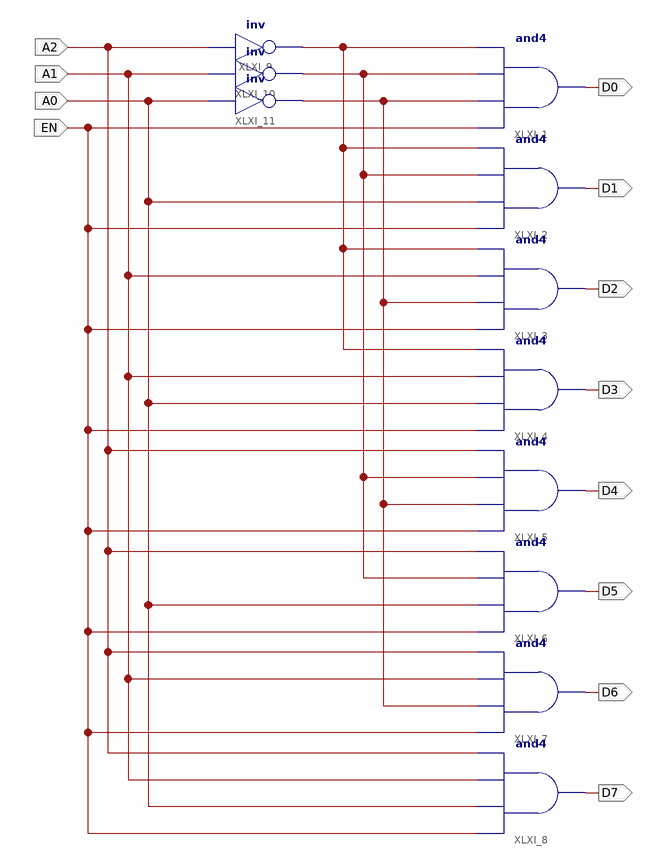
[diagram p0: schematic sheet 1]
// Xilinx ISE schematic D3_8E.sch (virtex6) as structural Verilog: 11 symbols, 12 ports
module D3_8E (
  input  A2,
  input  A1,
  input  A0,
  input  EN,
  output D0,
  output D1,
  output D2,
  output D3,
  output D4,
  output D5,
  output D6,
  output D7
);

  wire XLXN_23, XLXN_30, XLXN_33;

  and XLXI_1 (D0, EN, XLXN_33, XLXN_30, XLXN_23);
  and XLXI_2 (D1, EN, A0, XLXN_30, XLXN_23);
  and XLXI_3 (D2, EN, XLXN_33, A1, XLXN_23);
  and XLXI_4 (D3, EN, A0, A1, XLXN_23);
  and XLXI_5 (D4, EN, XLXN_33, XLXN_30, A2);
  and XLXI_6 (D5, EN, A0, XLXN_30, A2);
  and XLXI_7 (D6, EN, XLXN_33, A1, A2);
  and XLXI_8 (D7, EN, A0, A1, A2);
  not XLXI_9 (XLXN_23, A2);
  not XLXI_10 (XLXN_30, A1);
  not XLXI_11 (XLXN_33, A0);
endmodule
